# EAGLE schematic Sensor-platiene (EAGLE 9.6.2)
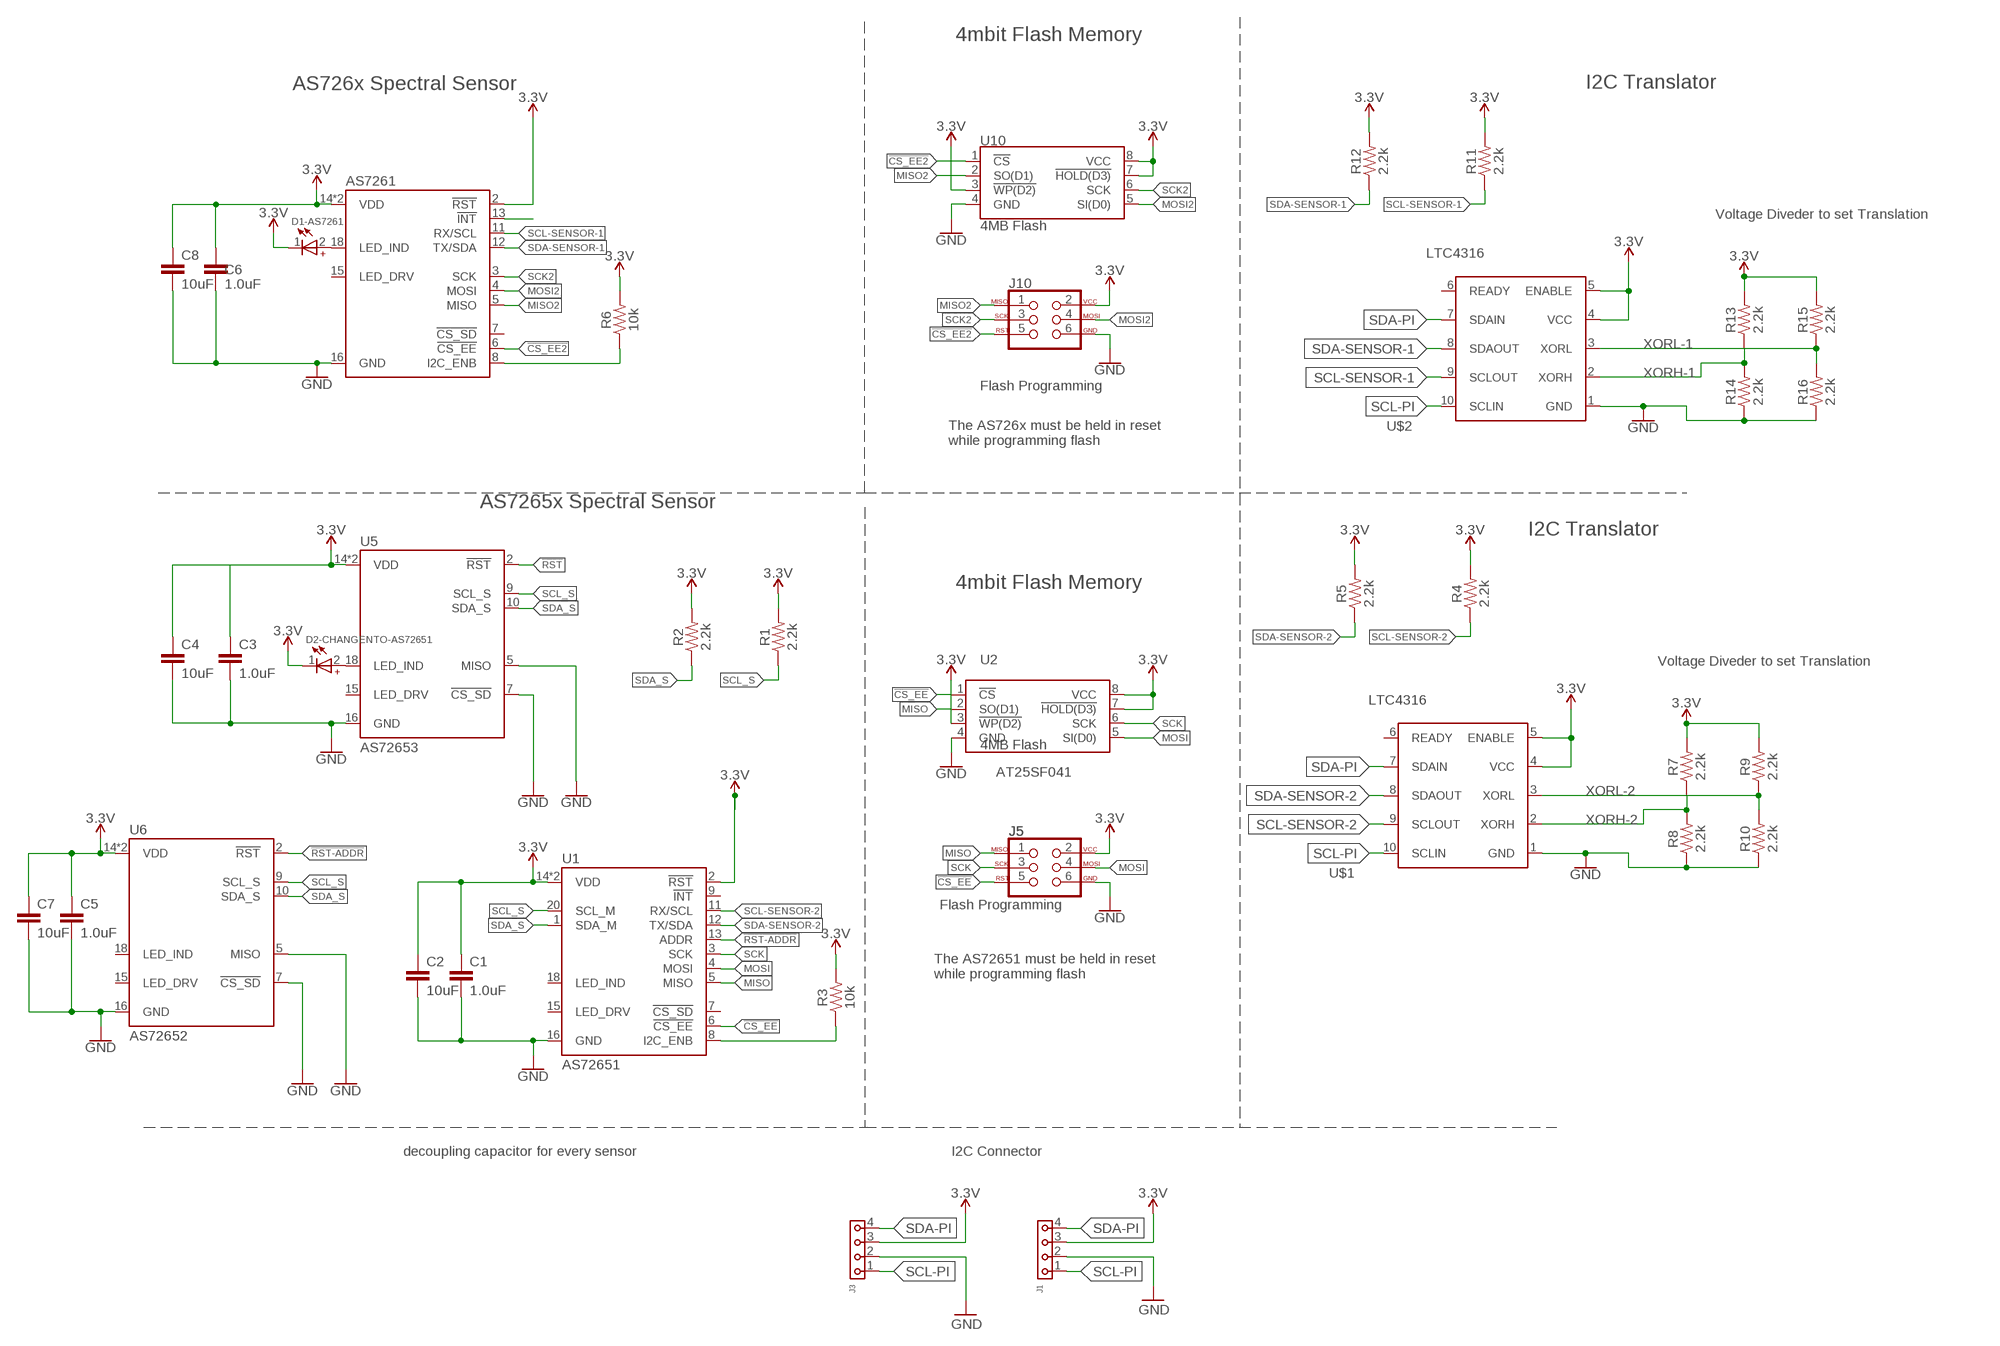
[diagram p0: schematic, sheet 1]

## Parts
AS7261  IR  AS726XIR  [LGA20]
C1  1.0uF  1.0UF-0603-16V-10%  [0603]
C2  10uF  10UF-0603-6.3V-20%  [0603]
C3  1.0uF  1.0UF-0603-16V-10%  [0603]
C4  10uF  10UF-0603-6.3V-20%  [0603]
C5  1.0uF  1.0UF-0603-16V-10%  [0603]
C6  1.0uF  1.0UF-0603-16V-10%  [0603]
C7  10uF  10UF-0603-6.3V-20%  [0603]
C8  10uF  10UF-0603-6.3V-20%  [0603]
D1-AS7261  WL-SMCW_1206_150120RS75000  [WL-SMCW_1206]
D2-CHANGENTO-AS72651  WL-SMCW_1206_150120RS75000  [WL-SMCW_1206]
J1  6130XX11821_61300411821  [61300411821]
J3  6130XX11821_61300411821  [61300411821]
J5  Flash Programming  AVR_SPI_PROG_3X2TESTPOINTS  [2X3_TEST_POINTS]
J10  Flash Programming  AVR_SPI_PROG_3X2TESTPOINTS  [2X3_TEST_POINTS]
R1  2.2k  2.2KOHM-0603-1/10W-1%  [0603]
R2  2.2k  2.2KOHM-0603-1/10W-1%  [0603]
R3  10k  10KOHM-0603-1/10W-1%  [0603]
R4  2.2k  2.2KOHM-0603-1/10W-1%  [0603]
R5  2.2k  2.2KOHM-0603-1/10W-1%  [0603]
R6  10k  10KOHM-0603-1/10W-1%  [0603]
R7  2.2k  2.2KOHM-0603-1/10W-1%  [0603]
R8  2.2k  2.2KOHM-0603-1/10W-1%  [0603]
R9  2.2k  2.2KOHM-0603-1/10W-1%  [0603]
R10  2.2k  2.2KOHM-0603-1/10W-1%  [0603]
R11  2.2k  2.2KOHM-0603-1/10W-1%  [0603]
R12  2.2k  2.2KOHM-0603-1/10W-1%  [0603]
R13  2.2k  2.2KOHM-0603-1/10W-1%  [0603]
R14  2.2k  2.2KOHM-0603-1/10W-1%  [0603]
R15  2.2k  2.2KOHM-0603-1/10W-1%  [0603]
R16  2.2k  2.2KOHM-0603-1/10W-1%  [0603]
U1  AS72651  [LGA20]
U2  4MB Flash  AT25SF041  [SO08]
U5  AS72653  [LGA20]
U6  AS72652  [LGA20]
U10  4MB Flash  AT25SF041  [SO08]
U$1  LTC4316  [MS-PACKAGE]
U$2  LTC4316  [MS-PACKAGE]

## Nets
3.3V [Power]: AS7261.2(!RST) AS7261.14(VDD) AS7261.17(VDD) C1.1 C2.1 C3.1 C4.1 C5.1 C6.1 C7.1 C8.1 D1-AS7261.1(-) D2-CHANGENTO-AS72651.1(-) J1.3 J3.3 J5.2 J10.2 R1.2 R2.2 R3.2 R4.2 R5.2 R6.2 R7.2 R9.2 R11.2 R12.2 R13.2 R15.2 U1.2(!RST) U1.14(VDD) U1.17(VDD) U2.3(!WP(D2)) U2.7(!HOLD(D3)) U2.8(VCC) U5.14(VDD) U5.17(VDD) U6.14(VDD) U6.17(VDD) U10.3(!WP(D2)) U10.7(!HOLD(D3)) U10.8(VCC) U$1.4(VCC) U$1.5(ENABLE) U$2.4(VCC) U$2.5(ENABLE)
!CS_EE: J5.5 U1.6(!CS_EE) U2.1(!CS)
!CS_EE2: AS7261.6(!CS_EE) J10.5 U10.1(!CS)
!RST: U5.2(!RST)
!RST-ADDR: U1.13(ADDR) U6.2(!RST)
GND: AS7261.16(GND) C1.2 C2.2 C3.2 C4.2 C5.2 C6.2 C7.2 C8.2 J1.2 J3.2 J5.6 J10.6 R8.1 R10.1 R14.1 R16.1 U1.16(GND) U2.4(GND) U5.5(MISO) U5.7(!CS_SD) U5.16(GND) U6.5(MISO) U6.7(!CS_SD) U6.16(GND) U10.4(GND) U$1.1(GND) U$2.1(GND)
I2C_ENB: R3.1 U1.8(I2C_ENB)
MISO: J5.1 U1.5(MISO) U2.2(SO(D1))
MISO2: AS7261.5(MISO) J10.1 U10.2(SO(D1))
MOSI: J5.4 U1.4(MOSI) U2.5(SI(D0))
MOSI2: AS7261.4(MOSI) J10.4 U10.5(SI(D0))
N$1: AS7261.18(LED_IND) D1-AS7261.2(+)
N$3: AS7261.8(I2C_ENB) R6.1
N$4: D2-CHANGENTO-AS72651.2(+) U5.18(LED_IND)
N$6: AS7261.13(!INT)
SCK: J5.3 U1.3(SCK) U2.6(SCK)
SCK2: AS7261.3(SCK) J10.3 U10.6(SCK)
SCL-PI: J1.1 J3.1 U$1.10(SCLIN) U$2.10(SCLIN)
SCL-SENSOR-1: AS7261.11(RX/SCL) R11.1 U$2.9(SCLOUT)
SCL-SENSOR-2: R4.1 U1.11(RX/SCL) U$1.9(SCLOUT)
SCL_S: R1.1 U1.20(SCL_M) U5.9(SCL_S) U6.9(SCL_S)
SDA-PI: J1.4 J3.4 U$1.7(SDAIN) U$2.7(SDAIN)
SDA-SENSOR-1: AS7261.12(TX/SDA) R12.1 U$2.8(SDAOUT)
SDA-SENSOR-2: R5.1 U1.12(TX/SDA) U$1.8(SDAOUT)
SDA_S: R2.1 U1.1(SDA_M) U5.10(SDA_S) U6.10(SDA_S)
XORH-1 [Power]: R13.1 R14.2 U$2.2(XORH)
XORH-2 [Power]: R7.1 R8.2 U$1.2(XORH)
XORL-1 [Power]: R15.1 R16.2 U$2.3(XORL)
XORL-2 [Power]: R9.1 R10.2 U$1.3(XORL)
Unconnected: AS7261.7(!CS_SD) AS7261.15(LED_DRV) U1.7(!CS_SD) U1.9(!INT) U1.15(LED_DRV) U1.18(LED_IND) U5.15(LED_DRV) U6.15(LED_DRV) U6.18(LED_IND) U$1.6(READY) U$2.6(READY)

## Notes on the sheet
- 4mbit Flash Memory
- AS726x Spectral Sensor | I2C Translator
- Voltage Diveder to set Translation
- The AS726x must be held in reset 
  while programming flash
- AS7265x Spectral Sensor
- I2C Translator
- 4mbit Flash Memory
- Voltage Diveder to set Translation
- AT25SF041
- The AS72651 must be held in reset
  while programming flash
- decoupling capacitor for every sensor | I2C Connector

## Library data of the parts
AS7261 = SparkFun-Sensors:AS726X; PROD_ID: IC-13731
C1 C3 C5 C6 = SparkFun-Capacitors:1.0UF: 1µF ceramic capacitors A capacitor is a passive two-terminal electrical component used to store electrical energy temporarily in an electric field.; PROD_ID: CAP-00868
C2 C4 C7 C8 = SparkFun-Capacitors:10UF: 10.0µF ceramic capacitors A capacitor is a passive two-terminal electrical component used to store electrical energy temporarily in an electric field.; PROD_ID: CAP-11015
D1-AS7261 D2-CHANGENTO-AS72651 = 150120RS75000_Eagle_WL-SMCW_rev20b:WL-SMCW_1206: WL-SMCW SMT Mono-color Chip LED Waterclea Characteristics Low energy consumption High reliability Low current requirement Fast switching No UV/IR radiation Smallest SMD LED package for exceptional brightness Top view LED Wide viewing angle Better solder ability Heat dissipation Applications Backlight for mobile and portable device keypads Indoor and outdoor message boards Flat backlight for LCDs, switches and symbols Display for industrial control systems and traffic Miniaturized color effects Pedestrian mark Optical indicators Tabular backlight: LCD, telephone key-press, power-switch, display board Indoor displays Signals Identifiers Backlight for automobile DVD LED General lighting Toys <https://www.we-online.com/catalog/media/o14904v209%20Family_WL-SMCW.jpg> Details see: https://www.we-online.com/catalog/en/WL-SMCW/ Updated BY Yingchun,Shan 2020-03-18 2020(C) Wurth Elektronik; ABSTRAHLWINKEL: 140°; CHIP-TECHNOLOGY: AlInGaP; DATASHEET-URL: https://www.we-online.com/catalog/datasheet/150120RS75000.pdf; EMITTING-COLOR: Red; I-V-TYP: 150mcd; LAMDA-DOM-TYP: 625nm; LAMDA-PEAK-TYP: 630nm; PART-NUMBER: 150120RS75000; V-F-TYP: 2V
J1 J3 = 61300411121_Eagle_WR-PHD_rev19a:6130XX11821_61300411821: WR-PHD 2.54 mm Socket Header ARTICLE PROPERTIES: Pins:1;​ 2;​ 3;​ 4;​ 5;​ 6;​ 7;​ 8;​ 9;​ 10;​ 12;​ 13;​ 14;​ 15;​ 16;​ 18;​ 20;​ 22;​ 24;​ 25;​ 32;​ 36;​ 40 KIND PROPERTIES: Pitch：2.54 mm Quality Class:3 as per CECC 75 301-802 Rows：Single Gender：Socket Header;​ Female Type：Straight MATERIAL PROPERTIES: Insulator Material :PBT Insulator Flammability Rating:UL94 V-0 Contact Material:Copper Alloy Contact Plating:Gold Contact Type:Stamped GENERAL INFORMATION Operating Temperature:-40 up to +125 °C Compliance:Lead free / RoHS ELECTRICAL PROPERTIES: Rated Current:3 A IR 1:3 A Withstanding Voltage:500 V (AC) Contact Resistance:20 mΩ RISO:1000 MΩ CERTIFICATION UL Approval:E323964 PACKAGING PROPERTIES Packaging:Tray <https://katalog.we-online.com/media/images/v2/o33218v209%20Family_WR-PHD_613xxx11821.jpg> Details see: https://katalog.we-online.com/en/em/PHD_2_54_SOCKET_HEADER_6130XX11821 Updated by Yingchun,Shan 2019-10-21 2019 (C) Würth Elektronik; DATASHEET-URL: https://katalog.we-online.com/em/datasheet/61300411821.pdf; GENDER: Socket Header; IR: 3A; MATES: WR-PHD 2.54mm SMT Pin Header/THT Angled Pin Header/THT Pin Header; PACKAGING: Tray; PART-NUMBER: 61300411821; PINS: 4; ROWS: Single; TYPE: Straight
J5 J10 = SparkFun-Connectors:AVR_SPI_PROG_3X2: AVR ISP 6 Pin This is the reduced ISP connector for AVR programming. Common on Arduino. This footprint will take up less PCB space and can be used with a 10-pin to 6-pin adapter such as SKU: BOB-08508 **Special note about "TEST_POINT" package. The stop mask is on the top side, so if you want your programming test points to be on the bottom of your board, make sure to place this package on the bottom side of the board. This also ensure that the orientation to program from the bottom side will be correct. SparkFun Products: SparkFun ISP Pogo Adapter <https://www.sparkfun.com/products/11591> - NS Tiny AVR Programmer <https://www.sparkfun.com/products/11801> -PTH
R1 R2 R4 R5 R7-R16 = SparkFun-Resistors:2.2KOHM: 2.2kΩ resistor A resistor is a passive two-terminal electrical component that implements electrical resistance as a circuit element. Resistors act to reduce current flow, and, at the same time, act to lower voltage levels within circuits. - Wikipedia; PROD_ID: RES-08272
R3 R6 = SparkFun-Resistors:10KOHM: 10kΩ resistor A resistor is a passive two-terminal electrical component that implements electrical resistance as a circuit element. Resistors act to reduce current flow, and, at the same time, act to lower voltage levels within circuits. - Wikipedia; PROD_ID: RES-00824
U1 = Qwiic_Spectral_Sensor-AS7265x:AS72651; PROD_ID: IC-14127
U2 U10 = SparkFun-IC-Memory:AT25SF041: AT25SF041 4Mb Serial Flash Memory 104MHz, SPI, 8-SOIC Datasheet <http://www.adestotech.com/wp-content/uploads/DS-AT25SF041_044.pdf> SparkFun Products: SparkFun ESP8266 Thing <https://www.sparkfun.com/products/13231> SparkFun ESP8266 Thing - Dev Board <https://www.sparkfun.com/products/13711>; PROD_ID: IC-12455
U5 = Qwiic_Spectral_Sensor-AS7265x:AS72653; PROD_ID: IC-14129
U6 = Qwiic_Spectral_Sensor-AS7265x:AS72652; PROD_ID: IC-14128
U$1 U$2 = I2c-adress-translotor:LTC4316

## Net classes
1 Power: width 0.305 mm